# Altium project PCB_Project1.PrjPCB
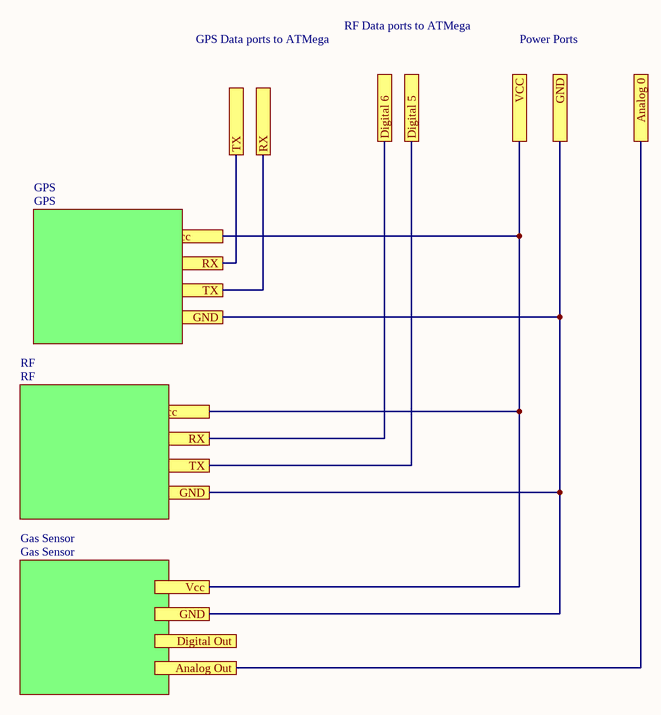
[diagram p0: Sheet1.SchDoc]
3 sheets, 1 parts. Net scope: flat (ports and power ports of the same name join across sheets).
Sheets:
  Sheet1.SchDoc
  Sheet2.SchDoc
  Sheet3.SchDoc

## Sheet Sheet1.SchDoc
size A

### Sub-sheets
Gas Sensor = Gas Sensor (file not in this document): no entries
GPS = GPS (file not in this document): no entries
RF = RF (file not in this document): no entries

### Ports
Analog 0, Analog Out, Digital 5, Digital 6, Digital Out, GND, RX, TX, Vcc, VCC

### Nets
NetIC?_2: port RX, port TX, port Digital 5, port Digital 6
NetIC?_7: port Vcc, port VCC
(unnamed): port Analog Out, port Analog 0

### Notes on the sheet
- RF Data ports to ATMega
- GPS Data ports to ATMega
- Power Ports

## Sheet Sheet2.SchDoc
size A
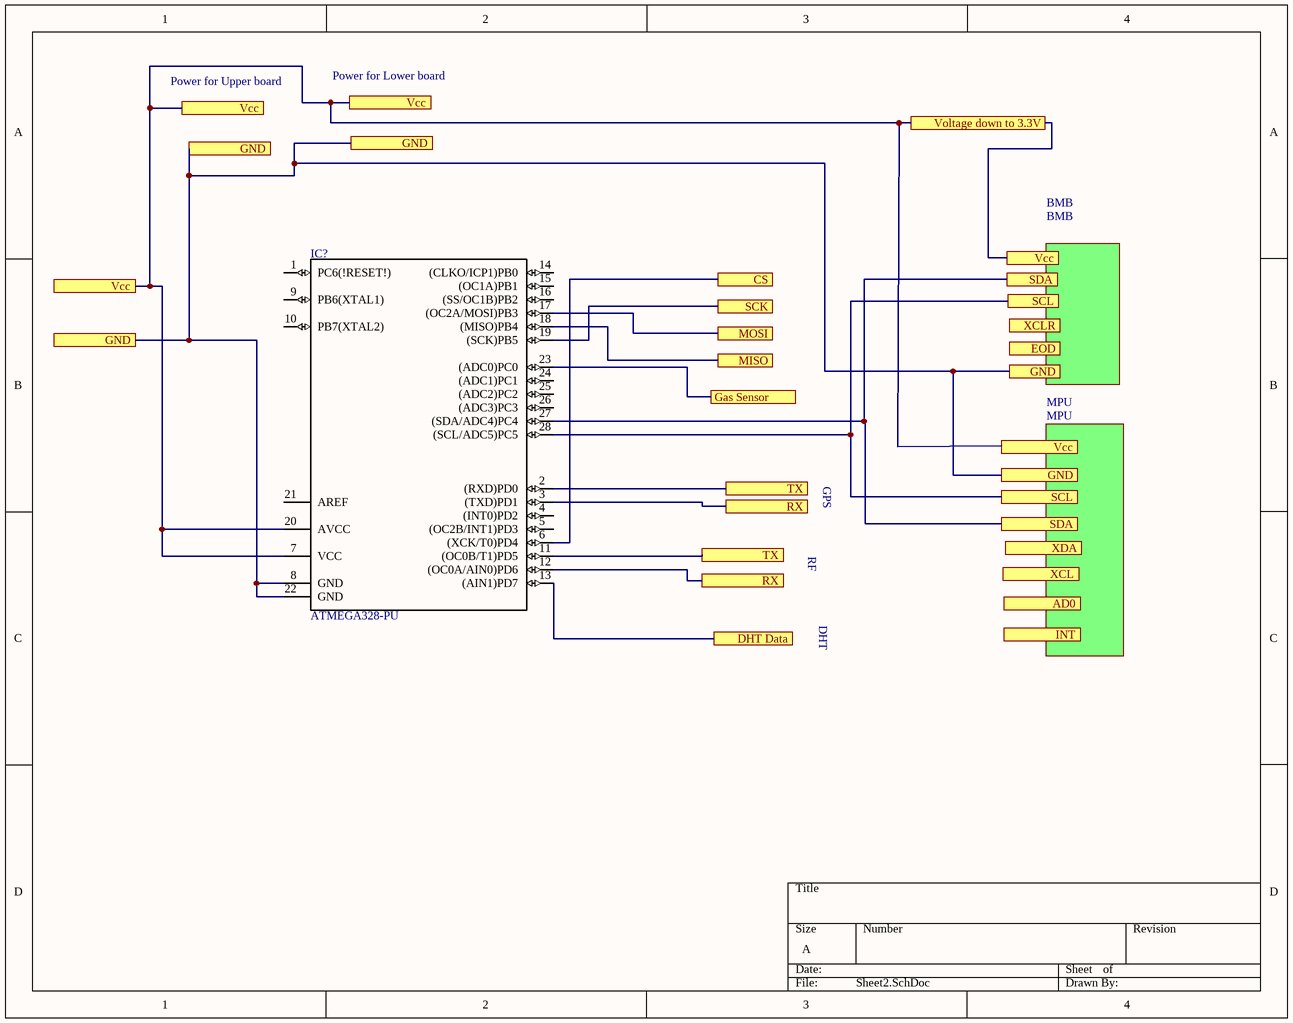
[diagram p1: Sheet2.SchDoc]

### Parts
IC?  ATMEGA328-PU  [*DIL28]

### Sub-sheets
BMB = BMB (file not in this document): no entries
MPU = MPU (file not in this document): no entries

### Ports
AD0, CS, DHT Data, EOD, Gas Sensor, GND, INT, MISO, MOSI, RX, SCK, SCL, SDA, TX, Vcc, Voltage down to 3.3V, XCL, XCLR, XDA

### Nets
NetIC?_2: IC?.2((RXD)PD0) IC?.3((TXD)PD1) IC?.11((OC0B/T1)PD5) IC?.12((OC0A/AIN0)PD6) ; port TX, port RX
NetIC?_6: IC?.6((XCK/T0)PD4) ; port CS
NetIC?_7: IC?.7(VCC) IC?.20(AVCC) ; port Vcc, port Voltage down to 3.3V
NetIC?_8: IC?.8(GND) IC?.22(GND) ; port GND
NetIC?_13: IC?.13((AIN1)PD7) ; port DHT Data
NetIC?_17: IC?.17((OC2A/MOSI)PB3) ; port MOSI
NetIC?_18: IC?.18((MISO)PB4) ; port MISO
NetIC?_19: IC?.19((SCK)PB5) ; port SCK
NetIC?_23: IC?.23((ADC0)PC0) ; port Gas Sensor
NetIC?_27: IC?.27((SDA/ADC4)PC4) ; port SDA
NetIC?_28: IC?.28((SCL/ADC5)PC5) ; port SCL

Not connected (* = marked no-connect by the designer): IC? 1(PC6(!RESET!)) 4((INT0)PD2) 5((OC2B/INT1)PD3) 9(PB6(XTAL1)) 10(PB7(XTAL2)) 14((CLKO/ICP1)PB0) 15((OC1A)PB1) 16((SS/OC1B)PB2) 21(AREF) 24((ADC1)PC1) 25((ADC2)PC2) 26((ADC3)PC3)

### Notes on the sheet
- Power for Upper board
- Power for Lower board
- GPS
- RF
- DHT

### Library data of the parts
IC? = ATMEGA328-PU: ATmega Series 20 MHz 32 KB Flash 2 KB SRAM 8-Bit Microcontroller - DIP-28; MF: Microchip; Package: PDIP-28 Microchip; Price: None; MP: ATMEGA328-PU; SnapEDA_Link: https://www.snapeda.com/parts/ATMEGA328-PU/Microchip/view-part/?ref=snap; Availability: Unavailable; Value: *

## Sheet Sheet3.SchDoc
size A
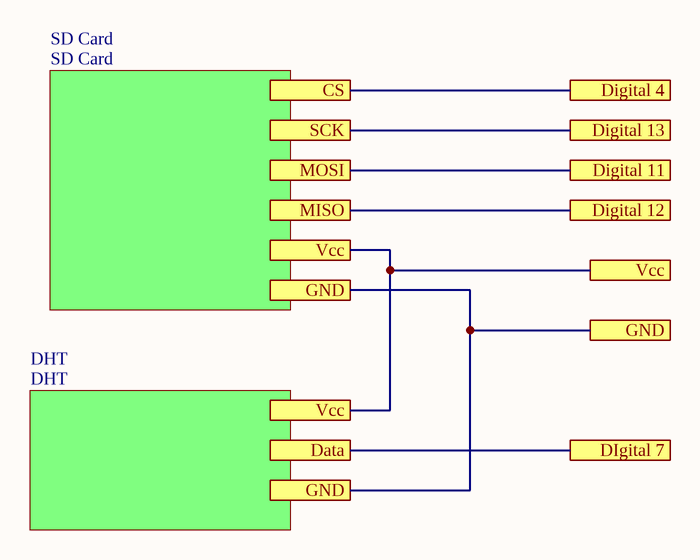
[diagram p2: Sheet3.SchDoc]

### Sub-sheets
DHT = DHT (file not in this document): no entries
SD Card = SD Card (file not in this document): no entries

### Ports
CS, Data, Digital 4, DIgital 7, Digital 11, Digital 12, Digital 13, GND, MISO, MOSI, SCK, Vcc

### Nets
NetIC?_6: port CS, port Digital 4
NetIC?_17: port MOSI, port Digital 11
NetIC?_18: port MISO, port Digital 12
NetIC?_19: port SCK, port Digital 13
(unnamed): port Data, port DIgital 7